# EAGLE design pcb (EAGLE 7.2.0)
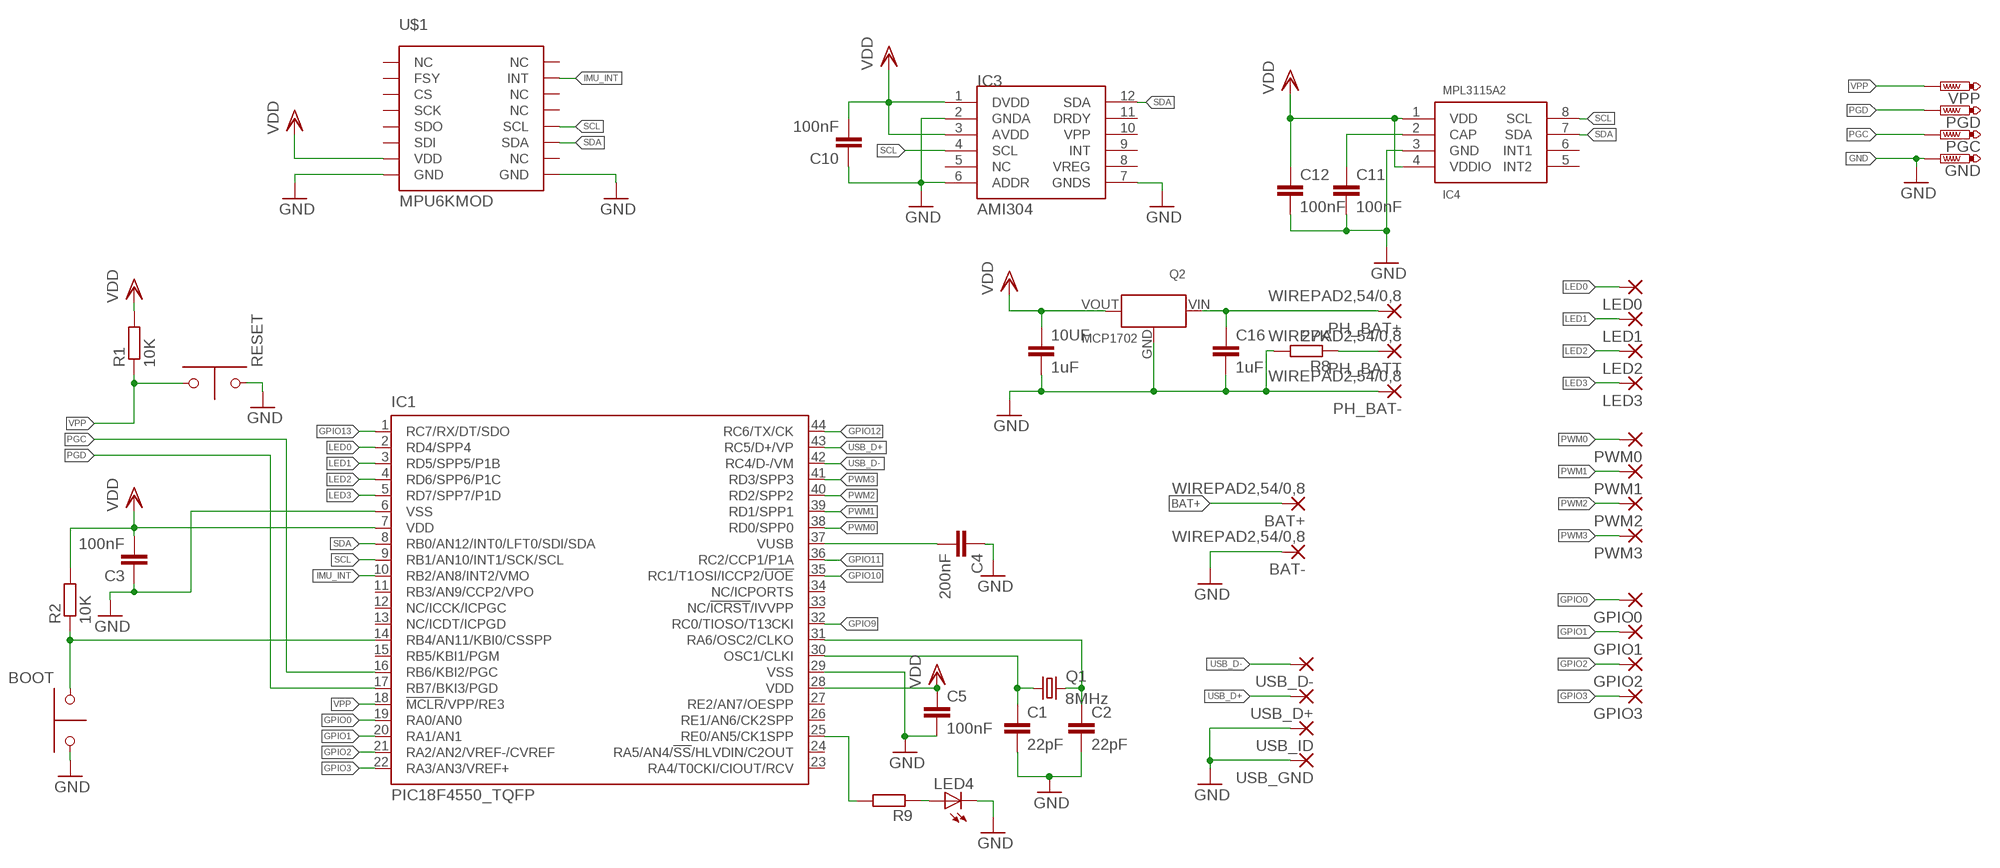
[diagram p0: schematic, sheet 1]

## Parts
10UF  1uF  C-EUC1206K  [C1206K]
BAT+  WIREPAD2,54/0,8  [2,54/0,8]
BAT-  WIREPAD2,54/0,8  [2,54/0,8]
BOOT  SW2  [SW2]
C1  22pF  C-EUC1206  [C1206]
C2  22pF  C-EUC1206  [C1206]
C3  100nF  C-EUC1206  [C1206]
C4  200nF  C-EUC1206  [C1206]
C5  100nF  C-EUC1206  [C1206]
C10  100nF  C-EUC1206  [C1206]
C11  100nF  C-EUC1206  [C1206]
C12  100nF  C-EUC1206  [C1206]
C16  1uF  C-EUC1206K  [C1206K]
GND  PTR1TP12SQ  [TP12SQ]
GPIO0  SMD2  [SMD1,27-2,54]
GPIO1  SMD2  [SMD1,27-2,54]
GPIO2  SMD2  [SMD1,27-2,54]
GPIO3  SMD2  [SMD1,27-2,54]
IC1  PIC18F4550_TQFP  [TQFP44]
IC3  AMI304  [LGA12]
IC4  MPL3115A2  [LGA8]
LED0  SMD2  [SMD1,27-2,54]
LED1  SMD2  [SMD1,27-2,54]
LED2  SMD2  [SMD1,27-2,54]
LED3  SMD2  [SMD1,27-2,54]
LED4  LEDKA-3528ASYC  [KA-3528ASYC]
PGC  PTR1TP12SQ  [TP12SQ]
PGD  PTR1TP12SQ  [TP12SQ]
PH_BAT+  WIREPAD2,54/0,8  [2,54/0,8]
PH_BAT-  WIREPAD2,54/0,8  [2,54/0,8]
PH_BATT  WIREPAD2,54/0,8  [2,54/0,8]
PWM0  SMD2  [SMD1,27-2,54]
PWM1  SMD2  [SMD1,27-2,54]
PWM2  SMD2  [SMD1,27-2,54]
PWM3  SMD2  [SMD1,27-2,54]
Q1  8MHz  CRYSTALHC49S  [HC49/S]
Q2  MCP1702  [TO-92]
R1  10K  R-EU_R1206  [R1206]
R2  10K  R-EU_R1206  [R1206]
R8  27K  R-EU_R1206  [R1206]
R9  R-EU_R1206  [R1206]
RESET  SW2  [SW2]
U$1  MPU6KMOD  [MPU6KMOD]
USB_D+  SMD2  [SMD1,27-2,54]
USB_D-  SMD2  [SMD1,27-2,54]
USB_GND  SMD2  [SMD1,27-2,54]
USB_ID  SMD2  [SMD1,27-2,54]
VPP  PTR1TP12SQ  [TP12SQ]

## Nets
BAT+: BAT+.1(P) C16.1 PH_BAT+.1(P) Q2.VIN
BATT: PH_BATT.1(P) R8.1
GND: 10UF.2 BAT-.1(P) BOOT.1 C1.2 C2.2 C3.1 C4.1 C5.2 C10.1 C11.2 C12.2 C16.2 GND.TP IC1.6(VSS) IC1.29(VSS) IC3.2(GNDA) IC3.6(ADDR) IC3.7(GNDS) IC4.3(GND) LED4.C PH_BAT-.1(P) Q2.GND R8.2 RESET.2 U$1.P$8(GND) U$1.P$16(GND) USB_GND.1(P) USB_ID.1(P)
GPIO0: GPIO0.1(P) IC1.19(RA0/AN0)
GPIO1: GPIO1.1(P) IC1.20(RA1/AN1)
GPIO2: GPIO2.1(P) IC1.21(RA2/AN2/VREF-/CVREF)
GPIO3: GPIO3.1(P) IC1.22(RA3/AN3/VREF+)
GPIO9: IC1.32(RC0/TIOSO/T13CKI)
GPIO10: IC1.35(RC1/T1OSI/ICCP2/!UOE)
GPIO11: IC1.36(RC2/CCP1/P1A)
GPIO12: IC1.44(RC6/TX/CK)
GPIO13: IC1.1(RC7/RX/DT/SDO)
IMU_INT: IC1.10(RB2/AN8/INT2/VMO) U$1.P$10(INT)
LED0: IC1.2(RD4/SPP4) LED0.1(P)
LED1: IC1.3(RD5/SPP5/P1B) LED1.1(P)
LED2: IC1.4(RD6/SPP6/P1C) LED2.1(P)
LED3: IC1.5(RD7/SPP7/P1D) LED3.1(P)
N$1: C1.1 IC1.30(OSC1/CLKI) Q1.1
N$3: C4.2 IC1.37(VUSB)
N$4: C2.1 IC1.31(RA6/OSC2/CLKO) Q1.2
N$5: BOOT.2 IC1.14(RB4/AN11/KBI0/CSSPP) R2.1
N$7: C11.1 IC4.2(CAP)
N$8: IC1.25(RE0/AN5/CK1SPP) R9.2
N$9: LED4.A R9.1
PGC: IC1.16(RB6/KBI2/PGC) PGC.TP
PGD: IC1.17(RB7/BKI3/PGD) PGD.TP
PWM0: IC1.38(RD0/SPP0) PWM0.1(P)
PWM1: IC1.39(RD1/SPP1) PWM1.1(P)
PWM2: IC1.40(RD2/SPP2) PWM2.1(P)
PWM3: IC1.41(RD3/SPP3) PWM3.1(P)
SCL: IC1.9(RB1/AN10/INT1/SCK/SCL) IC3.4(SCL) IC4.8(SCL) U$1.P$13(SCL)
SDA: IC1.8(RB0/AN12/INT0/LFT0/SDI/SDA) IC3.12(SDA) IC4.7(SDA) U$1.P$14(SDA)
USB_D+: IC1.43(RC5/D+/VP) USB_D+.1(P)
USB_D-: IC1.42(RC4/D-/VM) USB_D-.1(P)
VDD: 10UF.1 C3.2 C5.1 C10.2 C12.1 IC1.7(VDD) IC1.28(VDD) IC3.1(DVDD) IC3.3(AVDD) IC4.1(VDD) IC4.4(VDDIO) Q2.VOUT R1.2 R2.2 U$1.P$7(VDD)
VPP: IC1.18(!MCLR!/VPP/RE3) R1.1 RESET.1 VPP.TP
Unconnected: IC1.11(RB3/AN9/CCP2/VPO) IC1.12(NC/ICCK/ICPGC) IC1.13(NC/ICDT/ICPGD) IC1.15(RB5/KBI1/PGM) IC1.23(RA4/T0CKI/CIOUT/RCV) IC1.24(RA5/AN4/!SS!/HLVDIN/C2OUT) IC1.26(RE1/AN6/CK2SPP) IC1.27(RE2/AN7/OESPP) IC1.33(NC/!ICRST!/IVVPP) IC1.34(NC/ICPORTS) IC3.5(NC) IC3.8(VREG) IC3.9(INT) IC3.10(VPP) IC3.11(DRDY) IC4.5(INT2) IC4.6(INT1) U$1.P$1(NC) U$1.P$2(FSY) U$1.P$3(CS) U$1.P$4(SCK) U$1.P$5(SDO) U$1.P$6(SDI) U$1.P$9(NC) U$1.P$11(NC) U$1.P$12(NC) U$1.P$15(NC)

## Library data of the parts
10UF C1-C5 C10-C12 C16 = rcl:C-EU: CAPACITOR, European symbol
BAT+ BAT- PH_BAT+ PH_BAT- PH_BATT = wirepad:WIREPAD: Wire PAD connect wire on PCB
BOOT RESET = utils:SW2
GND PGC PGD VPP = testpad:PTR1: TEST PIN
GPIO0 GPIO1-GPIO3 LED0 LED1-LED3 PWM0 PWM1-PWM3 USB_D+ USB_D- USB_GND USB_ID = wirepad:SMD2: SMD PAD
IC1 = microchip:PIC18F4*_TQFP: USB Microcontrollers with nanoWatt Technology High-Performance, Enhanced Flash, 28/40/44-Pin, Source: http://ww1.microchip.com/downloads/en/devicedoc/39632c.pdf; MF: MICROCHIP; MPN: PIC18F4550-I/PT; OC_FARNELL: 9321365; OC_NEWARK: 08J9633
IC3 = sensors:AMI304
IC4 = sensors:MPL3115A2
LED4 = led:LED: LED OSRAM: - CHIPLED LG R971, LG N971, LY N971, LG Q971, LY Q971, LO R971, LY R971 LH N974, LH R974 LS Q976, LO Q976, LY Q976 LO Q996 - Hyper CHIPLED LW Q18S LB Q993, LB Q99A, LB R99A - SideLED LS A670, LO A670, LY A670, LG A670, LP A670 LB A673, LV A673, LT A673, LW A673 LH A674 LY A675 LS A676, LA A676, LO A676, LY A676, LW A676 LS A679, LY A679, LG A679 - Hyper Micro SIDELED® LS Y876, LA Y876, LO Y876, LY Y876 LT Y87S - SmartLED LW L88C, LW L88S LB L89C, LB L89S, LG L890 LS L89K, LO L89K, LY L89K LS L896, LA L896, LO L896, LY L896 - TOPLED LS T670, LO T670, LY T670, LG T670, LP T670 LSG T670, LSP T670, LSY T670, LOP T670, LYG T670 LG T671, LOG T671, LSG T671 LB T673, LV T673, LT T673, LW T673 LH T674 LS T676, LA T676, LO T676, LY T676, LB T676, LH T676, LSB T676, LW T676 LB T67C, LV T67C, LT T67C, LS T67K, LO T67K, LY T67K, LW E67C LS E67B, LA E67B, LO E67B, LY E67B, LB E67C, LV E67C, LT E67C LW T67C LS T679, LY T679, LG T679 LS T770, LO T770, LY T770, LG T770, LP T770 LB T773, LV T773, LT T773, LW T773 LH T774 LS E675, LA E675, LY E675, LS T675 LS T776, LA T776, LO T776, LY T776, LB T776 LHGB T686 LT T68C, LB T68C - Hyper Mini TOPLED® LB M676 - Mini TOPLED Santana® LG M470 LS M47K, LO M47K, LY M47K Source: http://www.osram.convergy.de LUXEON: - LUMILED® LXK2-PW12-R00, LXK2-PW12-S00, LXK2-PW14-U00, LXK2-PW14-V00 LXK2-PM12-R00, LXK2-PM12-S00, LXK2-PM14-U00 LXK2-PE12-Q00, LXK2-PE12-R00, LXK2-PE12-S00, LXK2-PE14-T00, LXK2-PE14-U00 LXK2-PB12-K00, LXK2-PB12-L00, LXK2-PB12-M00, LXK2-PB14-N00, LXK2-PB14-P00, LXK2-PB14-Q00 LXK2-PR12-L00, LXK2-PR12-M00, LXK2-PR14-Q00, LXK2-PR14-R00 LXK2-PD12-Q00, LXK2-PD12-R00, LXK2-PD12-S00 LXK2-PH12-R00, LXK2-PH12-S00 LXK2-PL12-P00, LXK2-PL12-Q00, LXK2-PL12-R00 Source: www.luxeon.com KINGBRIGHT: KA-3528ASYC Source: www.kingbright.com
Q1 = crystal:CRYSTAL: CRYSTAL; OC_FARNELL: 1667008; OC_NEWARK: unknown
Q2 = utils:MCP1702
R1 R2 R8 R9 = resistor:R-EU_: RESISTOR, European symbol
U$1 = sensors:MPU6KMOD

## Board
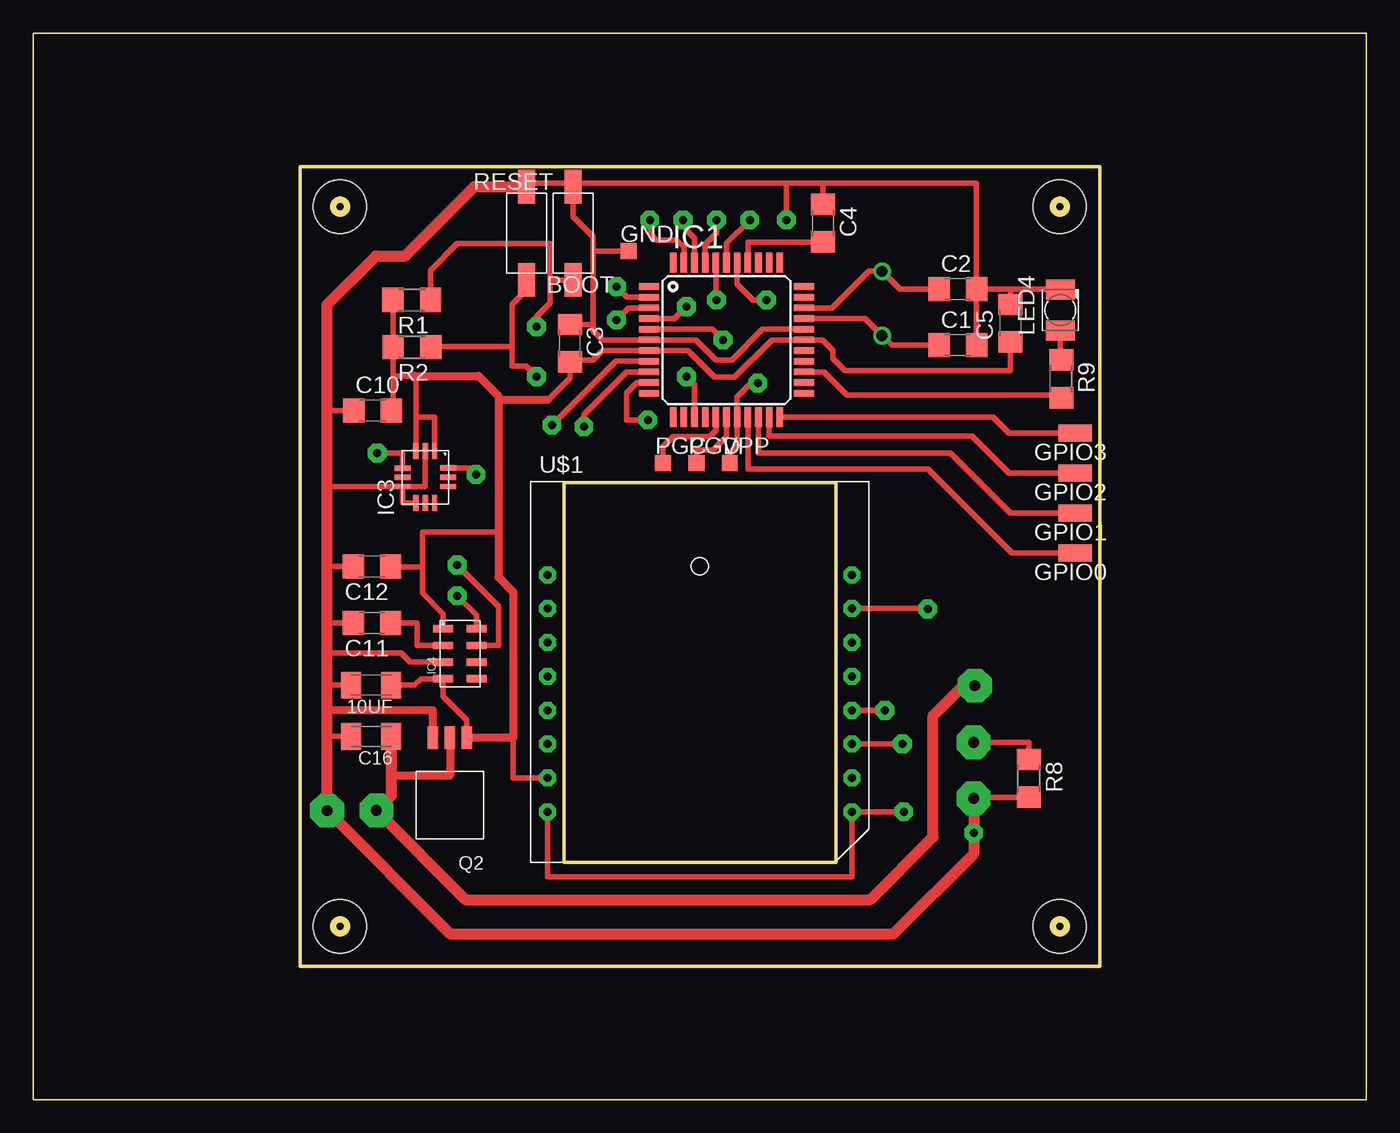
[diagram p1: board, top side]
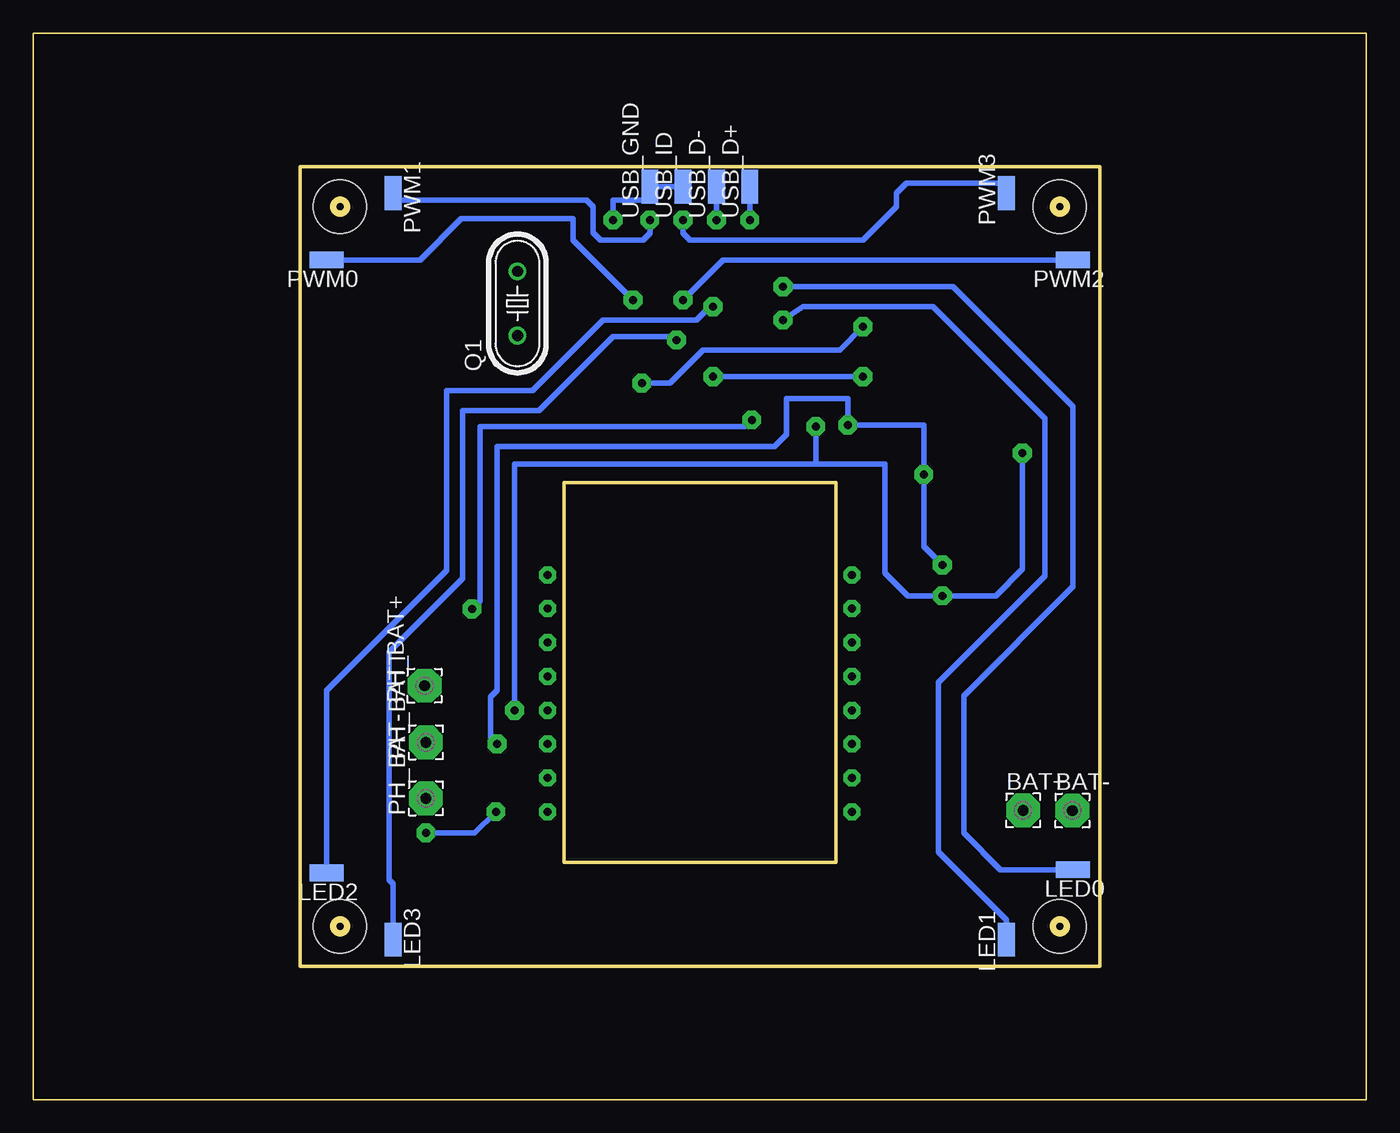
[diagram p2: board, bottom side, seen from below]

Size 100 x 80 mm. Coordinates in mm from the lower left corner, seen from the top.
Outline: 20,10 80,10 80,70 20,70 20,10
Outline: 39.8,17.8 39.8,46.3 60.2,46.3 60.2,17.8 39.8,17.8
Outline: 0,0 100,0 100,80 0,80 0,0
Outline: circle at 23,67 radius 0.5
Outline: circle at 77,67 radius 0.5
Outline: circle at 23,13 radius 0.5
Outline: circle at 77,13 radius 0.5
Copper layers (1*16): Top 0.035mm / dielectric 1.5mm / Bottom 0.035mm
Design rules "default": minimum track width 10mil, minimum drill 24mil, track to track 8mil, track to pad 8mil, pad to pad 8mil, via to via 8mil, smd to smd 8mil, copper to edge 40mil, drill to drill 8mil, minimum pad ring 10mil, minimum via ring 8mil, stop-mask expansion 4mil, vias tented up to drill 0mil, thermal gap 10mil
Holes 4 mm at 23,67 77,67 77,13 23,13

### Footprints (pad centres in the part's own frame; a part is rotated, then mirrored left to right if it is on the bottom)
C1206K = smd 1.5 x 2: 1 -1.5,0; 2 1.5,0
2,54/0,8 = drill 0.813 pad 2.54 octagon: 1 0,0
SW2 = smd 1.27 x 2.54: 1 0,3.5; 2 0,-3.5
C1206 = smd 1.6 x 1.8: 1 -1.4,0; 2 1.4,0
TP12SQ = smd 1.2 x 1.2: TP 0,0
SMD1,27-2,54 = smd 1.27 x 2.54: 1 0,0
TQFP44 = smd 1.5 x 0.5: 1 -5.8,4; 2 -5.8,3.2; 3 -5.8,2.4; 4 -5.8,1.6; 5 -5.8,0.8; 6 -5.8,0; 7 -5.8,-0.8; 8 -5.8,-1.6; 9 -5.8,-2.4; 10 -5.8,-3.2; 11 -5.8,-4; 23 5.8,-4; 24 5.8,-3.2; 25 5.8,-2.4; 26 5.8,-1.6; 27 5.8,-0.8; 28 5.8,0; 29 5.8,0.8; 30 5.8,1.6; 31 5.8,2.4; 32 5.8,3.2; 33 5.8,4 | smd 0.5 x 1.5: 12 -4,-5.8; 13 -3.2,-5.8; 14 -2.4,-5.8; 15 -1.6,-5.8; 16 -0.8,-5.8; 17 0,-5.8; 18 0.8,-5.8; 19 1.6,-5.8; 20 2.4,-5.8; 21 3.2,-5.8; 22 4,-5.8; 34 4,5.8; 35 3.2,5.8; 36 2.4,5.8; 37 1.6,5.8; 38 0.8,5.8; 39 0,5.8; 40 -0.8,5.8; 41 -1.6,5.8; 42 -2.4,5.8; 43 -3.2,5.8; 44 -4,5.8
LGA12 = smd 0.4 x 1.2: 1 0.7,1.95; 2 0,1.95; 3 -0.7,1.95; 7 -0.7,-1.95; 8 0,-1.95; 9 0.7,-1.95 | smd 1.2 x 0.4: 4 -1.7,0.673; 5 -1.7,0; 6 -1.7,-0.7; 10 1.7,-0.7; 11 1.7,0; 12 1.7,0.7
LGA8 = smd 1.5 x 0.55: 1 -1.25,1.875; 2 -1.25,0.625; 3 -1.25,-0.625; 4 -1.25,-1.875; 5 1.25,-1.875; 6 1.25,-0.625; 7 1.25,0.625; 8 1.25,1.875
KA-3528ASYC = smd 1.5 x 2.2: A -1.55,0; C 1.55,0
HC49/S = drill 0.813: 1 -2.413,0; 2 2.413,0
TO-92 = smd 0.813 x 1.676: GND 1.27,-3.81; VIN 0,-3.81; VOUT -1.27,-3.81
R1206 = smd 1.6 x 1.803: 1 -1.422,0; 2 1.422,0
MPU6KMOD = drill 0.6 pad 1.27 octagon: P$1 -11.43,7.62; P$2 -11.43,5.08; P$3 -11.43,2.54; P$4 -11.43,0; P$5 -11.43,-2.54; P$6 -11.43,-5.08; P$7 -11.43,-7.62; P$8 -11.43,-10.16; P$9 11.43,7.62; P$10 11.43,5.08; P$11 11.43,2.54; P$12 11.43,0; P$13 11.43,-2.54; P$14 11.43,-5.08; P$15 11.43,-7.62; P$16 11.43,-10.16

### Placement (x,y rotation side)
10UF  25.35,31.1 180 top
BAT+  25.74,21.69 0 bottom
BAT-  22.04,21.68 0 bottom
BOOT  37,65 0 top
C1  69.37,56.59 0 top
C2  69.37,60.8 0 top
C3  40.25,56.75 270 top
C4  59.25,65.75 270 top
C5  73.3,58.25 90 top
C10  25.45,51.7 0 top
C11  25.4,35.75 180 top
C12  25.4,40 180 top
C16  25.35,27.25 180 top
GND  44.65,63.65 0 top
GPIO0  78.16,41 90 top
GPIO1  78.16,44 90 top
GPIO2  78.16,47 90 top
GPIO3  78.16,50 90 top
IC1  52,57 0 top
IC3  29.4,46.7 0 top
IC4  32,33.45 0 top
LED0  22,17.25 90 bottom
LED1  27,12 0 bottom
LED2  78,17 90 bottom
LED3  73,12 180 bottom
LED4  77.05,59.23 90 top
PGC  47.25,47.75 0 top
PGD  49.75,47.75 0 top
PH_BAT+  70.65,31.05 90 bottom
PH_BAT-  70.55,22.6 90 bottom
PH_BATT  70.55,26.8 90 bottom
PWM0  78,63 90 bottom
PWM1  73,68 180 bottom
PWM2  22,63 90 bottom
PWM3  27,68 0 bottom
Q1  63.68,59.73 90 bottom
Q2  31.25,23.35 180 top
R1  28.39,60 180 top
R2  28.41,56.45 180 top
R8  74.7,24.1 270 top
R9  77.12,54.07 270 top
RESET  40.5,65 180 top
U$1  50,31.75 0 top
USB_D+  46.25,68.5 0 bottom
USB_D-  48.75,68.5 0 bottom
USB_GND  53.75,68.5 0 bottom
USB_ID  51.25,68.5 0 bottom
VPP  52.25,47.75 0 top

### Tracks (layer width: path | path; a pad name or v marks a point on that pad's centre or on a via)
BAT+
  Top 0.61: Q2.VIN 31.25,24.3 26.85,24.3
  Top 0.813: C16.1 26.85,24.3 26.85,22.8 BAT+.1 32.43,15 62.8,15 67.5,19.7 67.5,28.8 69.75,31.05 PH_BAT+.1
BATT
  Top 0.4: R8.1 74.7,26.8 PH_BATT.1
GND  (via drill 0.6 pad 1.42)
  Top 0.4: BOOT.1 arc-90 37.25,68.75 40.5,68.75 | 56.5,68.75 v56.5,66 | C4.1 59.25,68.75 | 59.25,68.75 56.5,68.75 | 65.4,68.75 59.25,68.75 | 56.5,68.75 40.5,68.75 | 40.5,68.75 RESET.2 40.5,66.25 42,64.75 42,63.9 | 42,63.9 42,58.15 C3.1 | C16.2 22.09,27.25 | 10UF.2 22.04,31.1 | C11.2 22.19,35.75 | IC4.3 28.27,32.83 27.6,33.5 22.04,33.5 | C12.2 22.04,40 22.04,39.6 | C10.1 22.24,51.7 22.04,51.9 | IC3.6 22.04,46 | IC3.2 29.4,46 IC3.6 | IC3.6 27.7,44.75 IC3.7 | GND.TP 42.25,63.65 arc-90 42,63.9 | C5.2 73.3,60.78 | C1.2 C2.2 | 73.3,60.78 73.3,60.8 77.03,60.8 arc-90 LED4.C | C2.2 70.77,68.75 68.2,68.75 | PH_BAT-.1 70.55,22.68 R8.2 | U$1.P$8 38.57,16.7 61.43,16.7 U$1.P$16 v65.3,21.6 | 73.3,60.78 arc90 73.28,60.8 C2.2
  Top 0.406: 65.4,68.75 68.2,68.75 68.37,68.75 | IC1.29 54.7,57.8 52.4,55.5 51.2,55.5 49.7,57 IC1.6 42.7,57 42,57.7 42,58.15
  Top 0.61: 22.19,35.75 arc-90 22.04,35.9 | Q2.GND 29.98,29.2 22.14,29.2 arc90 22.04,29.1
  Top 0.813: 22.04,27.3 BAT-.1 31.32,12.4 64.5,12.4 70.55,18.45 v70.55,20 PH_BAT-.1 | 22.04,27.3 22.04,29.1 22.04,31.1 22.04,33.5 22.04,35.9 22.04,39.6 22.04,46 22.04,51.9 22.04,59.64 25.7,63.3 27.9,63.3 33.1,68.5 BOOT.1 | 22.09,27.25 22.04,27.3
  Bottom 0.4: USB_ID.1 USB_GND.1 53.75,67.5 56.5,67.5 v56.5,66 | v65.3,21.6 66.9,20 v70.55,20
GPIO0
  Top 0.406: IC1.19 53.6,47.3 67.1,47.3 73.4,41 GPIO0.1
GPIO1
  Top 0.406: IC1.20 54.4,48.5 68.8,48.5 73.3,44 GPIO1.1
GPIO2
  Top 0.406: IC1.21 55.2,49.8 70.4,49.8 73.2,47 GPIO2.1
GPIO3
  Top 0.406: IC1.22 72,51.2 73.2,50 GPIO3.1
IMU_INT  (via drill 0.6 pad 1.42)
  Top 0.4: U$1.P$10 66.5,36.83 v67.1,36.8 | v46.1,51 44.5,51 44.5,53 45.3,53.8 IC1.10
  Bottom 0.4: v46.1,51 46.6,50.5 66.5,50.5 66.5,37.4 v67.1,36.8
LED0  (via drill 0.6 pad 1.42)
  Top 0.4: IC1.2 44.55,60.2 v43.75,61
  Bottom 0.4: v43.75,61 31,61 22,52 22,38.5 30.2,30.3 30.2,20 27.45,17.25 LED0.1
LED1  (via drill 0.6 pad 1.42)
  Top 0.4: IC1.3 44.65,59.4 v43.75,58.5
  Bottom 0.4: 27.25,11.25 27,11.5 LED1.1 | v43.75,58.5 42.25,59.5 32.5,59.5 24.1,51.1 24.1,39.3 32.1,31.3 32.1,18.6 27,13.5 LED1.1 | LED1.1 27,11.4 27,11.25
LED2  (via drill 0.6 pad 1.42)
  Top 0.4: IC1.4 48.1,58.6 v49,59.5
  Bottom 0.4: v49,59.5 49.25,59.25 49.5,59.25 50.25,58.5 57.25,58.5 62.55,53.2 69,53.2 69,39.7 78,30.7 LED2.1
LED3  (via drill 0.6 pad 1.42)
  Top 0.4: IC1.5 50.95,57.8 v51.75,57
  Bottom 0.4: v51.75,57 52.25,57.25 56.5,57.25 62.05,51.7 67.8,51.7 67.8,39.1 73.3,33.6 73.3,16.5 73,16.2 LED3.1
N$1
  Top 0.4: 59.4,58.6 62.4,58.6 Q1.1 64.41,56.59 C1.1
  Top 0.406: IC1.30 59.4,58.6
N$3
  Top 0.4: IC1.37 53.6,64.35 C4.2
N$4
  Top 0.4: 59.94,59.4 62.68,62.14 Q1.2 65.02,60.8 C2.1
  Top 0.406: IC1.31 59.94,59.4
N$5  (via drill 0.6 pad 1.42)
  Top 0.4: 37,60.75 BOOT.2 | IC1.14 49.6,53.65 v49,54.25
  Top 0.406: 37,60.75 35.9,59.65 35.9,56.5 | 35.9,56.5 35.9,55.05 36.95,55.05 v37.75,54.25 | R2.1 29.88,56.5 35.9,56.5
  Bottom 0.4: v49,54.25 v37.75,54.25
N$7
  Top 0.4: IC4.2 28.8,34.08 28.8,35.75 C11.1
N$8
  Top 0.4: 61.05,52.85 74.72,52.85 76.92,52.85 arc-90 R9.2
  Top 0.406: 61.05,52.85 59.3,54.6 IC1.25
N$9
  Top 0.4: LED4.A 77.05,55.56 arc90 R9.1
PGC
  Top 0.4: IC1.16 51.2,50.2 50.75,49.75 48,49.75 47.25,49 PGC.TP
PGD
  Top 0.4: IC1.17 52,49.75 51,48.75 49.75,48.75 PGD.TP 50,48
PWM0  (via drill 0.6 pad 1.42)
  Top 0.4: IC1.38 52.8,61.2 54,60 v55,60
  Bottom 0.4: PWM0.1 71,63
  Bottom 0.406: 71,63 67.9,66.1 59.5,66.1 59.5,64.5 v55,60
PWM1  (via drill 0.6 pad 1.42)
  Top 0.4: IC1.39 52,64.25 v53.75,66
  Bottom 0.4: PWM1.1 73,67.5 58.46,67.5 | 57.46,64.5 54.25,64.5 53.75,65 v53.75,66
  Bottom 0.406: 57.46,64.5 58,65.04 58,67 58.46,67.46 58.46,67.5
PWM2  (via drill 0.6 pad 1.42)
  Top 0.4: IC1.40 51.2,60.05 v51.25,60
  Bottom 0.4: PWM2.1 48.25,63 v51.25,60
PWM3  (via drill 0.6 pad 1.42)
  Top 0.4: IC1.41 50.4,64.15 51.25,65 v51.25,66
  Bottom 0.4: PWM3.1 27,68.75 34.5,68.75 35.25,68 35.25,67 37.75,64.5 50.75,64.5 51.25,65 v51.25,66
SCL  (via drill 0.6 pad 1.42)
  Top 0.4: IC4.8 33.25,36.35 v31.8,37.8 | IC3.4 27.7,48.5 v25.8,48.5 | IC1.9 44.5,54.6 41.3,51.4 v41.3,50.5 | U$1.P$13 v63.9,29.21
  Bottom 0.4: v63.9,29.21 63.9,47.7 41.3,47.7 | v25.8,48.5 25.8,39.8 27.8,37.8 v31.8,37.8 34.4,37.8 36.1,39.5 36.1,47.7 41.3,47.7 | 41.3,48.4 v41.3,50.5 41.3,47.7
SDA  (via drill 0.6 pad 1.42)
  Top 0.4: IC4.7 34.9,34.08 34.9,37 v31.8,40.1 | IC1.8 43.7,55.4 v38.9,50.6 | IC3.12 32.7,47.4 v33.2,46.9 | U$1.P$14 v65.2,26.67
  Bottom 0.4: v31.8,40.1 33.2,41.5 v33.2,46.9 33.2,50.6 v38.9,50.6 38.9,52.6 43.5,52.6 43.5,49.9 44.4,49 65.2,49 65.2,30.7 65.7,30.2 65.7,27.17 v65.2,26.67
USB_D+  (via drill 0.6 pad 1.42)
  Top 0.4: IC1.43 48.8,63.95 48.25,64.5 46.75,64.5 46.25,65 v46.25,66
  Bottom 0.4: USB_D+.1 v46.25,66
USB_D-  (via drill 0.6 pad 1.42)
  Top 0.4: IC1.42 49.6,64.65 49,65.25 49,65.75 v48.75,66
  Bottom 0.4: USB_D-.1 v48.75,66
VDD
  Top 0.4: IC1.7 42.7,56.2 42,55.5 40.4,55.5 C3.2 | R2.2 26.99,54.3 | 10UF.1 28.6,31.1 29.07,31.57 IC4.4 30.75,30.25 32.52,28.48 Q2.VOUT | C10.2 26.99,51.7 26.99,54.3 | 26.99,54.3 28.6,54.3 28.7,54.2 28.7,51.2 | 29.2,39.95 29.2,38 30.75,36.45 IC4.1 | C12.1 26.85,39.95 29.2,39.95 | 36,27.16 36,24.13 U$1.P$7 | IC3.3 28.7,51.2 | 35.2,52.5 34.9,52.8 | 34.9,42.6 29.2,42.6 29.2,39.95 | C5.1 73.3,54.7 71.2,54.7 | IC3.1 30.1,51.2 28.7,51.2
  Top 0.406: 71.2,54.7 60.9,54.7 60,55.6 60,56.2 59.2,57 IC1.28 55.4,57 52.6,54.2 51.1,54.2 49.1,56.2 IC1.7 | C3.2 40.25,54.15 38.6,52.5 | R1.2 26.99,59.98 R2.2
  Top 0.61: 28.6,54.3 33.4,54.3 34.9,52.8 34.9,42.6 34.9,39.2 36,38.1 36,27.16 Q2.VOUT | 38.6,52.5 35.2,52.5
VPP  (via drill 0.6 pad 1.42)
  Top 0.4: 52.8,52.7 IC1.18 52.8,49.05 52.25,48.5 VPP.TP | 38.75,59.75 38.75,61.5 RESET.1
  Top 0.406: 52.8,52.7 53.85,53.75 v54.35,53.75 | 38.75,59.75 37.75,58.75 v37.75,58 37.75,58.7 | 38.75,61.5 38.75,64.2 31.8,64.2 29.81,62.21 R1.1
  Bottom 0.4: v37.75,58 39.5,56.25 49.75,56.25 51.75,54.25
  Bottom 0.406: 51.75,54.25 52.25,53.75 v54.35,53.75